# EAGLE design LEDCON.PCB (EAGLE 6.5.0)
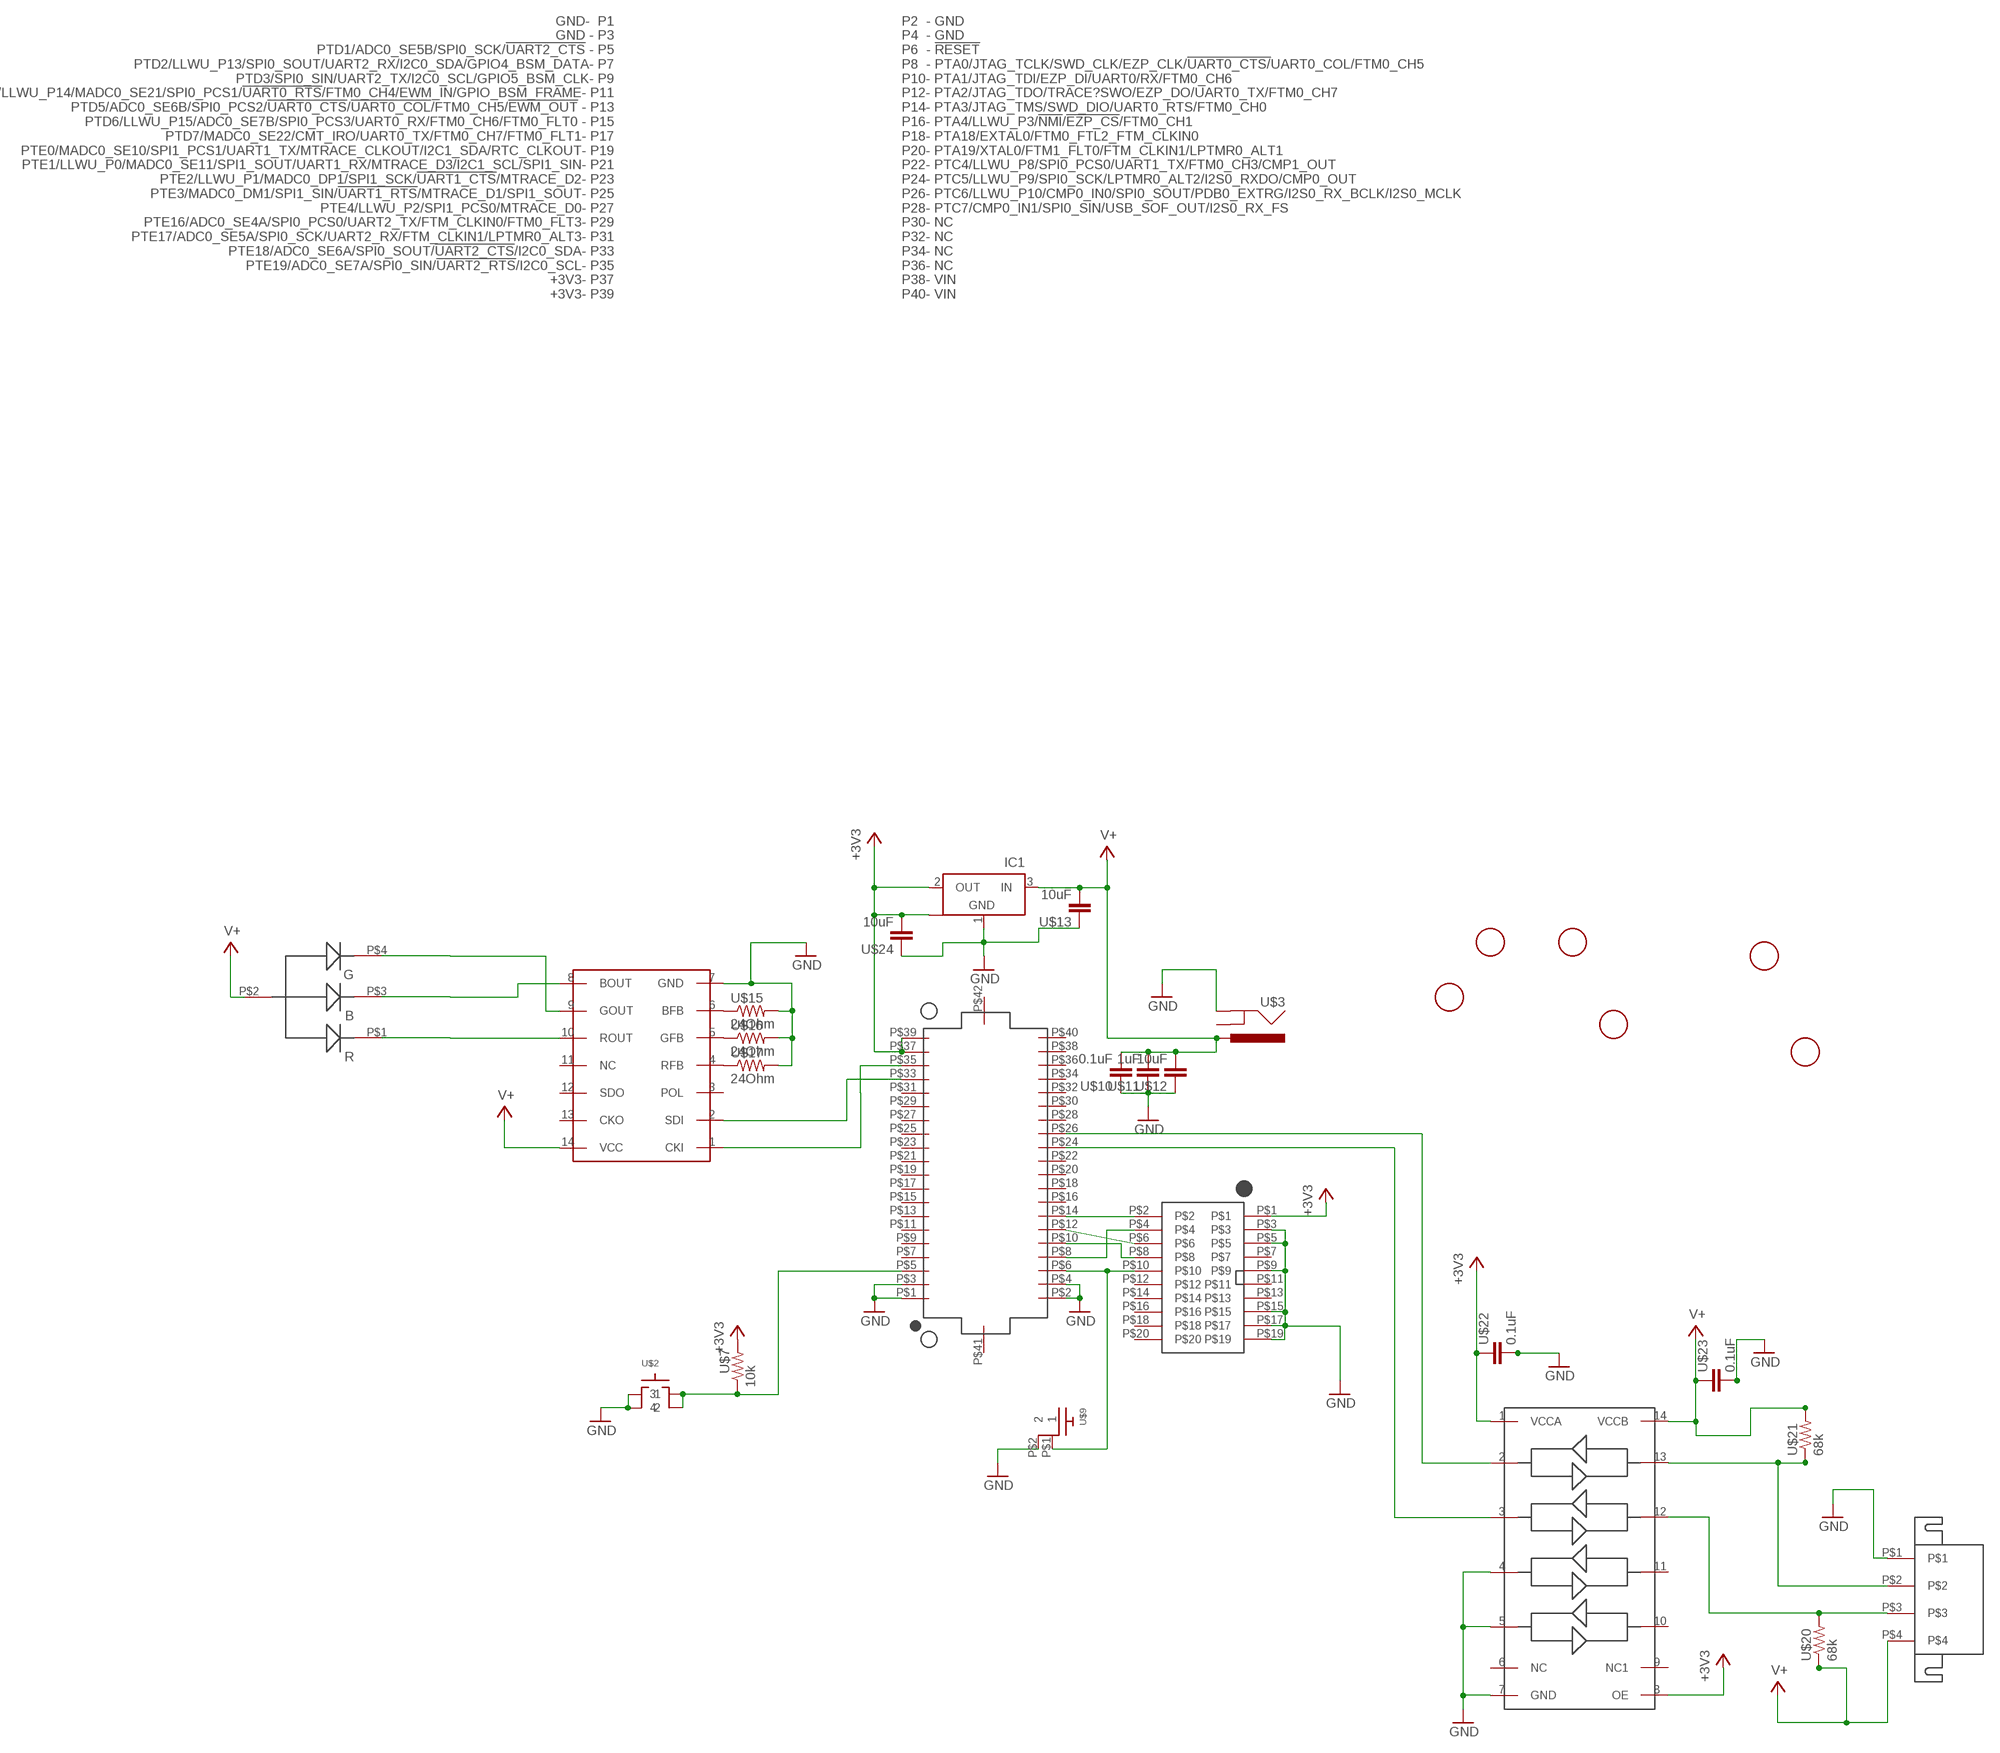
[diagram p0: schematic, sheet 1]

## Parts
IC1  NCP1117ST33T3G_1  [SOT223]
U$1  MATE-N-LOK_643230-1  [MATE-N-LOK_643230-1]
U$2  SWITCH-TACTILE  [ESWITCH-TL3301PF]
U$3  BARREL_CUI_PJ-002A  [BARREL_CUI_PJ-002A]
U$4  DF12_F  [DF12_F]
U$5  RGLBED  [PLCC4_SMALL]
U$6  TXB0104  [PW_R-PDSO-G14]
U$7  10k  RF-R0805  [RF-C0805]
U$8  WS2801  [SO14]
U$9  RA_BUTTON  [RA_BUTTON]
U$10  0.1uF  RF-C0805  [C0805]
U$11  1uF  RF-C0805  [C0805]
U$12  10uF  RF-C0805  [C0805]
U$13  10uF  RF-C0805  [C0805]
U$14  FIDUCIAL  [FIDUCIAL_1MM]
U$15  24Ohm  RF-R0805  [RF-C0805]
U$16  24Ohm  RF-R0805  [RF-C0805]
U$17  24Ohm  RF-R0805  [RF-C0805]
U$18  FIDUCIAL  [FIDUCIAL_1MM]
U$19  2X10JTAG  [2X10JTAG]
U$20  68k  RF-R0805  [RF-C0805]
U$21  68k  RF-R0805  [RF-C0805]
U$22  0.1uF  RF-C0805  [C0805]
U$23  0.1uF  RF-C0805  [C0805]
U$24  10uF  RF-C0805  [C0805]
U$25  FIDUCIAL  [FIDUCIAL_1MM]
U$26  FIDUCIAL  [FIDUCIAL_1MM]
U$27  FIDUCIAL  [FIDUCIAL_1MM]
U$28  FIDUCIAL  [FIDUCIAL_1MM]

## Nets
+3V3: IC1.2(OUT) IC1.4(OUT1) U$4.P$37(+3V3) U$4.P$39(+3V3) U$6.1(VCCA) U$6.8(OE) U$7.2 U$19.P$1 U$22.1 U$24.2
CLK_5V: U$1.P$3 U$6.12 U$20.2
DAT_5V: U$1.P$2 U$6.13 U$21.1
GND: IC1.1(GND) U$1.P$1 U$2.1 U$2.2 U$3.P$2(GND) U$4.P$1(GND) U$4.P$2(GND) U$4.P$3(GND) U$4.P$4(GND) U$6.4 U$6.5 U$6.7(GND) U$8.7(GND) U$9.P$2 U$10.1 U$11.1 U$12.1 U$13.1 U$15.2 U$16.2 U$17.2 U$19.P$3 U$19.P$5 U$19.P$9 U$19.P$15 U$19.P$17 U$19.P$19 U$22.2 U$23.2 U$24.1
N$1: U$4.P$26(PTC6/LLWU_P10/CMP0_IN0/SPI0_SOUT/PDB0_EXTRG/I2S0_RX_BCLK/I2S0_MCLK) U$6.2
N$2: U$4.P$24(PTC5/LLWU_P8/SPI0_PCS0/UART1_TX/FTM0_CH3/CMP1_OUT) U$6.3
N$3: U$4.P$6(!RESET) U$9.P$1 U$19.P$10
N$4: U$5.P$4(GREEN) U$8.9(GOUT)
N$5: U$5.P$3(BLUE) U$8.8(BOUT)
N$6: U$4.P$14(PTA3/JTAG_TMS/SWD_DIO/UART0_RTS/FTM0_CH0) U$19.P$2
N$7: U$5.P$1(RED) U$8.10(ROUT)
N$8: U$4.P$12(PTA2/JTAG_TDO/TRACE?SWO/EZP_DO/UART0_TX/FTM0_CH7) U$19.P$6
N$10: U$4.P$33(PTE18/ADC0_SE6A/SPI0_SOUT/!UART2_CTS!/I2C0_SDA) U$8.2(SDI)
N$11: U$8.6(BFB) U$15.1
N$12: U$8.5(GFB) U$16.1
N$13: U$8.4(RFB) U$17.1
N$14: U$4.P$35(PTE19/ADC0_SE7A/SPI0_SIN/!UART2_RTS!/I2C0_SCL) U$8.1(CKI)
N$18: U$4.P$8(PTA0/JTAG_TCLK/SWD_CLK/EZP_CLK/!UART0_CTS/!UART0_COL/FTM0_CH5) U$19.P$4
N$20: U$4.P$10(PTA1/JTAG_TDI/EZP_DI/UART0/RX/FTM0_CH6) U$19.P$8
N$21: U$2.3 U$2.4 U$4.P$5(PTD1/ADC0_SE5B/SPI0_SCK/!UART2_CTS) U$7.1
V+: IC1.3(IN) U$1.P$4 U$3.P$1(PWR) U$5.P$2(ANODE) U$6.14(VCCB) U$8.14(VCC) U$10.2 U$11.2 U$12.2 U$13.2 U$20.1 U$21.2 U$23.1
Unconnected: U$3.P$3(GNDBREAK) U$4.P$7(PTD2/LLWU_P13/SPI0_SOUT/UART2_RX/I2C0_SDA/GPIO4_BSM_DATA) U$4.P$9(PTD3/SPI0_SIN/UART2_TX/I2C0_SCL/GPIO5_BSM_CLK) U$4.P$11(PTD4/LLWU_P14/MADC0_SE21/SPI0_PCS1/!UART0_RTS!/FTM0_CH4/EWM_IN/GPIO_BSM_FRAME) U$4.P$13(PTD5/ADC0_SE6B/SPI0_PCS2/!UART0_CTS!/!UART0_COL!/FTM0_CH5/!EWM_OUT) U$4.P$15(PTD6/LLWU_P15/ADC0_SE7B/SPI0_PCS3/UART0_RX/FTM0_CH6/FTM0_FLT0) U$4.P$16(PTA4/LLWU_P3/!NMI!/!EZP_CS!/FTM0_CH1) U$4.P$17(PTD7/MADC0_SE22/CMT_IRO/UART0_TX/FTM0_CH7/FTM0_FLT1) U$4.P$18(PTA18/EXTAL0/FTM0_FTL2_FTM_CLKIN0) U$4.P$19(PTE0/MADC0_SE10/SPI1_PCS1/UART1_TX/MTRACE_CLKOUT/I2C1_SDA/RTC_CLKOUT) U$4.P$20(PTA19/XTAL0/FTM1_FLT0/FTM_CLKIN1/LPTMR0_ALT1) U$4.P$21(PTE1/LLWU_P0/MADC0_SE11/SPI1_SOUT/UART1_RX/MTRACE_D3/I2C1_SCL/SPI1_SIN) U$4.P$22(PTC4/LLWU_P8/SPI0_PCS0/UART1_TX/FTM0_CH3/CMP1_OUT) U$4.P$23(PTE2/LLWU_P1/MADC0_DP1/SPI1_SCK/!UART1_CTS!/MTRACE_D2) U$4.P$25(PTE3/MADC0_DM1/SPI1_SIN/!UART1_RTS!/MTRACE_D1/SPI1_SOUT) U$4.P$27(PTE4/LLWU_P2/SPI1_PCS0/MTRACE_D0) U$4.P$28(PTC7/CMP0_IN1/SPI0_SIN/USB_SOF_OUT/I2S0_RX_FS) U$4.P$29(PTE16/ADC0_SE4A/SPI0_PCS0/UART2_TX/FTM_CLKIN0/FTM0_FLT3) U$4.P$30(NC) U$4.P$31(PTE17/ADC0_SE5A/SPI0_SCK/UART2_RX/FTM_CLKIN1/LPTMR0_ALT3) U$4.P$32(NC) U$4.P$34(NC) U$4.P$36(NC) U$4.P$38(VIN) U$4.P$40(VIN) U$4.P$41 U$4.P$42 U$6.6(NC) U$6.9(NC1) U$6.10 U$6.11 U$8.3(POL) U$8.11(NC) U$8.12(SDO) U$8.13(CKO) U$19.P$7 U$19.P$11 U$19.P$12 U$19.P$13 U$19.P$14 U$19.P$16 U$19.P$18 U$19.P$20

## Library data of the parts
IC1 = KW2:NCP1117ST33T3G_1: VOLTAGE REGULATOR; MFGN: OnSemi; MFGP: NCP1117ST33T3G
U$1 = KW2:MATE-N-LOK_643230-1; MFGN: TE Connectivity; MFGP: 643230-1
U$2 = GW-devices:SWITCH-TACTILE; MFGN: E-Switch; MFGP: TL3301PF160QG
U$3 = KW2:BARREL_CUI_PJ-002A; MFGN: CUI; MFGP: PJ-002A
U$4 = KW2:DF12_F; MFGN: Hirose; MFGP: DF12(3.0)-40DP-0.5V(86)
U$5 = KW2:RGLBED; MFGN: Cree, Inc.; MFGP: CLV1A-FKB-CK1N1G1BB7R4S3
U$6 = texas:TXB0104; MFGN: Texas Instruments; MFGP: TXB0104PWR
U$7 = GW-devices:RF-R: RF resistor pads for FSL reference design; MFGN: Vishay Dale; MFGP: CRCW080510K0FKEA
U$8 = GW-devices:WS2801; MFGN: WorldSemi; MFGP: WS2801
U$9 = KW2:RA_BUTTON; MFGN: TE Connectivity; MFGP: 2-1825027-0
U$10 U$22 U$23 = GW-devices:RF-C: RF capacitor pads for FSL reference design; MFGN: TDK; MFGP: C2012X5R1H104K085AA
U$11 = GW-devices:RF-C: RF capacitor pads for FSL reference design; MFGN: TDK; MFGP: C2012X5R1E105K125AA
U$12 U$13 U$24 = GW-devices:RF-C: RF capacitor pads for FSL reference design; MFGN: Murata; MFGP: GRM219R61E106KA12D
U$14 U$18 U$25-U$28 = adafruit:FIDUCIAL: For use by pick and place machines to calibrate the vision/machine, 1mm By microbuilder.eu; NOTES: DNP
U$15-U$17 = GW-devices:RF-R: RF resistor pads for FSL reference design; MFGN: Vishay Dale; MFGP: CRCW080524R0FKEA
U$19 = KW2:2X10JTAG; MFGN: CNC Tech; MFGP: 3220-20-0100-00
U$20 U$21 = GW-devices:RF-R: RF resistor pads for FSL reference design; MFGN: Vishay Dale; MFGP: CRCW080568K0FKEA

## Board
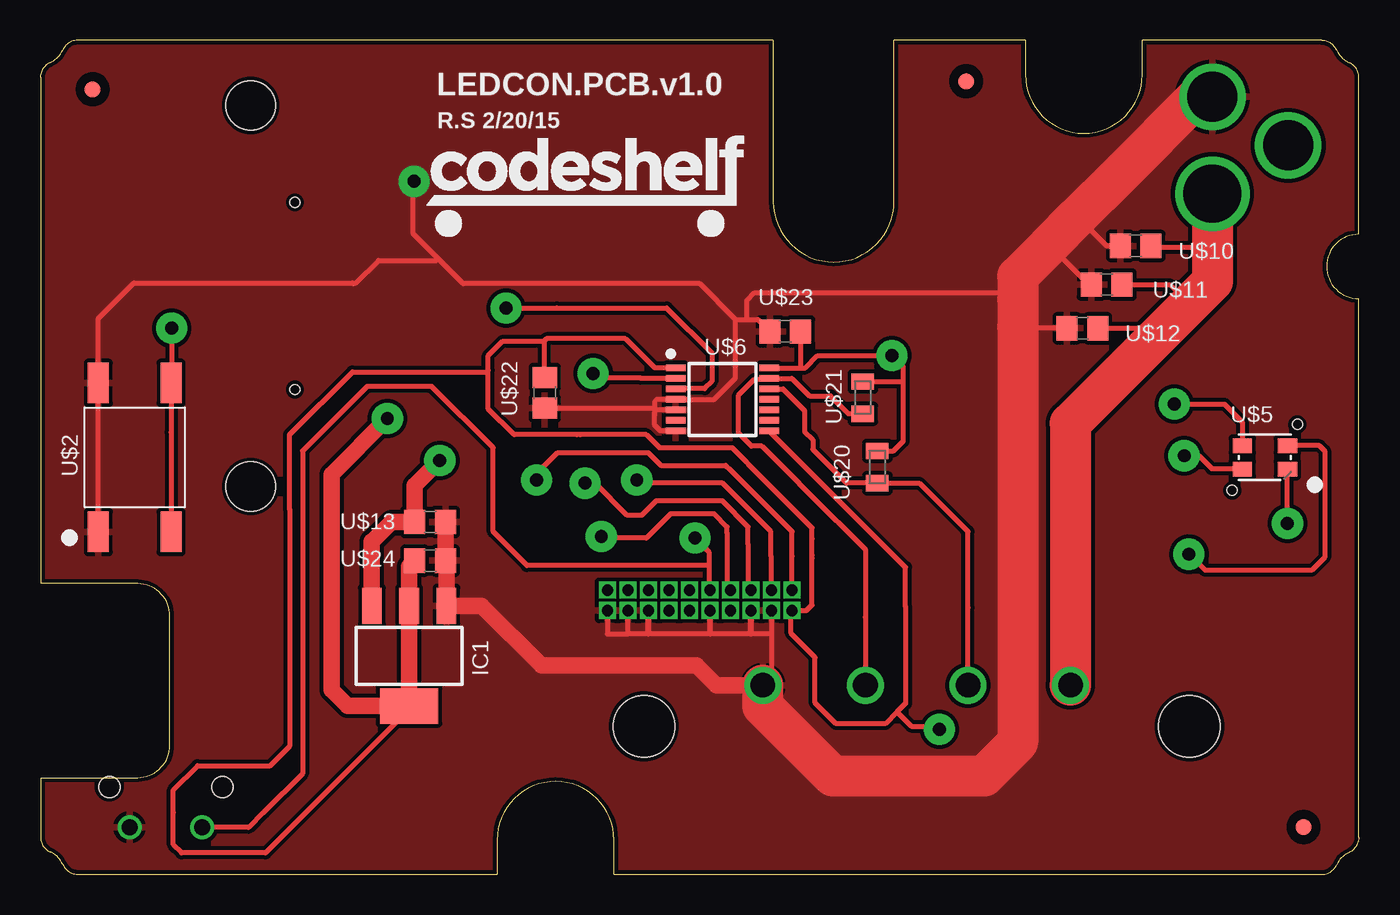
[diagram p1: board, top side]
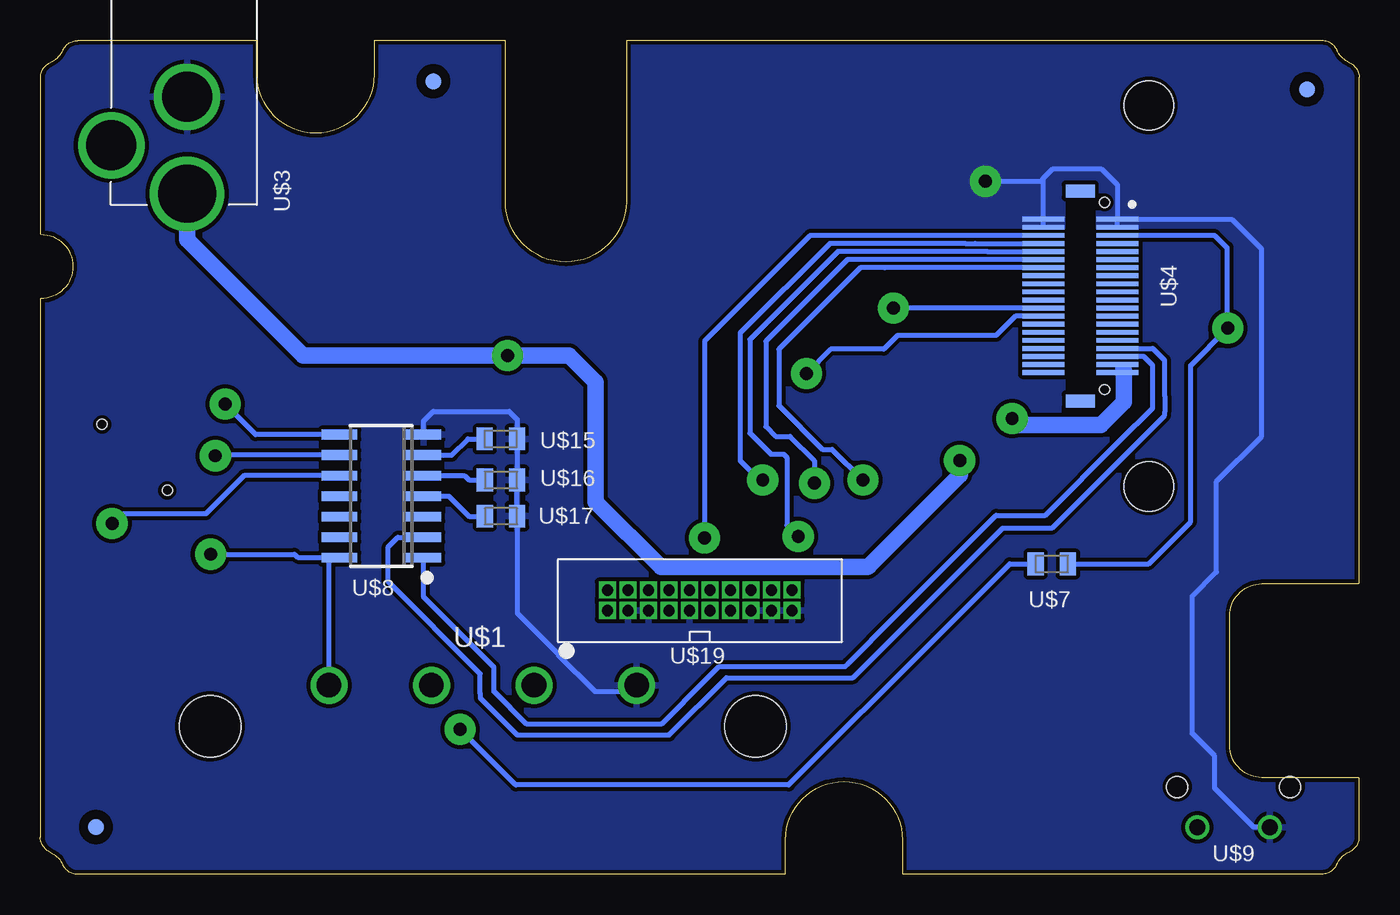
[diagram p2: board, bottom side, seen from below]

Size 81.68 x 51.66 mm. Coordinates in mm from the lower left corner, seen from the top.
Outline: 81.66,2.29 81.66,35.66 arc-180 81.66,39.65 81.66,49.38 arc66 81.07,50.28
Outline: 2.31,0 28.29,0 28.29,2.13 arc-180 35.53,2.13 35.53,0 79.37,0 arc67 80.29,0.61
Outline: 79.37,51.66 68.25,51.66 68.25,49.53 arc-180 61.01,49.53 61.01,51.66 52.88,51.66 52.88,41.68 arc-180 45.39,41.68 45.39,51.66 2.31,51.66 arc67 1.39,51.06
Outline: 0.02,49.38 0.02,18.01 6.02,18.01 arc-90 8.02,16 8.02,8 arc-90 6.02,5.99 0.02,5.99 0.02,2.29 arc66 0.61,1.38
Outline: 81.68,2.29 arc-66 81.07,1.37 arc43 80.3,0.6
Outline: 2.31,0.01 arc-67 1.39,0.61 arc43 0.61,1.39
Outline: 0,49.38 arc-66 0.61,50.29 arc43 1.38,51.06
Outline: 79.37,51.66 arc-67 80.29,51.05 arc43 81.07,50.28
Copper layers (1*16): Top 0.035mm / dielectric 1.5mm / Bottom 0.035mm
Design rules "default *": minimum track width 2.75mil, minimum drill 6mil, track to track 0.25mm, track to pad 0.25mm, pad to pad 0.25mm, via to via 0.25mm, smd to smd 0.25mm, copper to edge 0.25mm, drill to drill 0.25mm, minimum pad ring 6mil, minimum via ring 8mil, stop-mask expansion 4mil, vias tented up to drill 0.81mm, thermal gap 10mil

### Footprints (pad centres in the part's own frame; a part is rotated, then mirrored left to right if it is on the bottom)
SOT223 = smd 1.219 x 2.235: 1 -2.311,-3.099; 2 0,-3.099; 3 2.311,-3.099 | smd 3.6 x 2.2: 4 0,3.099
MATE-N-LOK_643230-1 = drill 1.52: P$1 0,0; P$2 6.35,0; P$3 12.7,0; P$4 19.05,0 | hole 3.81: -7.37,2.54; 26.42,2.54
ESWITCH-TL3301PF = smd 2.5 x 1.3: 1 -4.61,2.25; 2 4.61,2.25; 3 -4.61,-2.25; 4 4.61,-2.25
BARREL_CUI_PJ-002A = drill 3.6: P$1 0,0 | drill 3.1: P$2 6,0; P$3 3,4.7
DF12_F = smd 0.3 x 2.6: P$1 -4.75,2.3; P$2 -4.75,-2.3; P$3 -4.25,2.3; P$4 -4.25,-2.3; P$5 -3.75,2.3; P$6 -3.75,-2.3; P$7 -3.25,2.3; P$8 -3.25,-2.3; P$9 -2.75,2.3; P$10 -2.75,-2.3; P$11 -2.25,2.3; P$12 -2.25,-2.3; P$13 -1.75,2.3; P$14 -1.75,-2.3; P$15 -1.25,2.3; P$16 -1.25,-2.3; P$17 -0.75,2.3; P$18 -0.75,-2.3; P$19 -0.25,2.3; P$20 -0.25,-2.3; P$21 0.25,2.3; P$22 0.25,-2.3; P$23 0.75,2.3; P$24 0.75,-2.3; P$25 1.25,2.3; P$26 1.25,-2.3; P$27 1.75,2.3; P$28 1.75,-2.3; P$29 2.25,2.3; P$30 2.25,-2.3; P$31 2.75,2.3; P$32 2.75,-2.3; P$33 3.25,2.3; P$34 3.25,-2.3; P$35 3.75,2.3; P$36 3.75,-2.3; P$37 4.25,2.3; P$38 4.25,-2.3; P$39 4.75,2.3; P$40 4.75,-2.3 | smd 0.8 x 1.8: P$41 -6.5,0; P$42 6.5,0 | hole 0.6: -5.8,1.5; 5.8,1.5 | hole 3.048: -11.8,4.24; 11.8,4.24
PLCC4_SMALL = smd 1.2 x 0.9: P$1 1.4,-0.725; P$2 1.4,0.725; P$3 -1.4,0.725; P$4 -1.4,-0.725 | hole 0.61: 2.019,2.045; -2.019,-2.045
PW_R-PDSO-G14 = smd 0.4 x 1.2: 1 -1.95,-2.9; 2 -1.3,-2.9; 3 -0.65,-2.9; 4 0,-2.9; 5 0.65,-2.9; 6 1.3,-2.9; 7 1.95,-2.9; 8 1.95,2.9; 9 1.3,2.9; 10 0.65,2.9; 11 0,2.9; 12 -0.65,2.9; 13 -1.3,2.9; 14 -1.95,2.9
RF-C0805 = smd 1 x 1.4: 1 -1,0; 2 1,0
SO14 = smd 0.6 x 2.2: 1 -3.81,-2.6; 2 -2.54,-2.6; 3 -1.27,-2.6; 4 0,-2.6; 5 1.27,-2.6; 6 2.54,-2.6; 7 3.81,-2.6; 8 3.81,2.6; 9 2.54,2.6; 10 1.27,2.6; 11 0,2.6; 12 -1.27,2.6; 13 -2.54,2.6; 14 -3.81,2.6
RA_BUTTON = drill 0.99: P$1 -2.25,0; P$2 2.25,0 | hole 1.3: -3.501,2.49; 3.501,2.49
C0805 = smd 1.3 x 1.5: 1 -0.95,0; 2 0.95,0
FIDUCIAL_1MM = smd 1 x 1: 1 0,0
2X10JTAG = drill 0.7 pad 1 square: P$1 -6.35,-1.27; P$2 -6.35,0; P$3 -5.08,-1.27; P$4 -5.08,0; P$5 -3.81,-1.27; P$6 -3.81,0; P$7 -2.54,-1.27; P$8 -2.54,0; P$9 -1.27,-1.27; P$10 -1.27,0; P$11 0,-1.27; P$12 0,0; P$13 1.27,-1.27; P$14 1.27,0; P$15 2.54,-1.27; P$16 2.54,0; P$17 3.81,-1.27; P$18 3.81,0; P$19 5.08,-1.27; P$20 5.08,0

### Placement (x,y rotation side)
IC1  22.84,13.53 180 top
U$1  44.75,11.71 180 bottom
U$2  5.84,25.83 90 top
U$3  72.59,42.16 90 bottom
U$4  17.27,35.83 270 bottom
U$5  75.84,25.83 0 top
U$6  42.24,29.42 270 top
U$7  19.04,19.23 180 bottom
U$8  60.55,23.43 90 bottom
U$9  7.77,2.92 0 bottom
U$10  67.84,38.93 0 top
U$11  66.04,36.53 0 top
U$12  64.54,33.83 0 top
U$13  24.14,21.83 180 top
U$14  78.24,2.93 0 top
U$15  53.16,26.97 0 bottom
U$16  53.15,24.43 0 bottom
U$17  53.15,22.19 0 bottom
U$18  3.24,48.63 0 top
U$19  40.2,17.61 0 bottom
U$20  51.84,25.23 270 top
U$21  50.94,29.53 90 top
U$22  31.24,29.83 270 top
U$23  46.14,33.63 180 top
U$24  24.14,19.43 180 top
U$25  57.34,49.13 0 top
U$26  57.34,49.13 0 bottom
U$27  3.24,48.63 0 bottom
U$28  78.24,2.93 0 bottom

### Tracks (layer width: path | path; a pad name or v marks a point on that pad's centre or on a via)
+3V3  (via drill 0.8 pad 1.93)
  Top 0.305: 53.06,10.06 53.59,10.58 53.59,16.58 53.59,19.02 U$6.8 45.18,27.43 | 53.06,10.06 52.34,9.33 49.29,9.33 47.99,10.63 47.99,13.43 46.49,14.93 46.49,16.27 U$19.P$1 47.44,16.34 47.79,16.68 47.79,19.58 47.79,19.78 47.79,20.78 47.79,21.48 47.74,21.53 43.84,25.43 43.74,25.53 42.84,26.43 42.14,26.43 38.34,26.43 37.54,27.23 33.44,27.23 | 53.06,10.06 53.94,9.18 55.49,9.18 v55.69,8.98 | U$6.1 38.04,31.38 36.24,33.18 31.34,33.18 31.26,33.11 | 33.44,27.23 33.24,27.23 | U$22.1 31.24,33.08 31.26,33.11 | 33.44,27.23 29.34,27.23 27.74,28.83 27.74,31.23 | IC1.4 22.84,10.23 13.94,1.33 8.74,1.33 8.24,1.83 8.24,3.83 8.24,5.23 9.74,6.73 14.24,6.73 15.29,7.78 | 27.74,31.23 27.64,31.13 19.34,31.13 15.44,27.23 15.44,22.63 15.44,7.93 15.29,7.78 | 27.74,31.23 27.74,32.13 28.64,33.03 31.19,33.03 31.26,33.11 | 15.29,7.78 15.34,7.83
  Top 1.016: U$24.2 22.84,19.08 IC1.2 IC1.4 19.04,10.43 18.04,11.43 18.04,24.78 v21.49,28.23
  Bottom 0.305: 55.44,9.23 v55.69,8.98 52.24,5.53 35.34,5.53 26.24,14.63 21.64,19.23 U$7.2 | U$4.P$37 U$4.P$39 14.82,31.23 14.57,31.23
  Bottom 1.016: v21.49,28.23 21.09,27.83 18.19,27.83 15.99,27.83 14.57,29.25 14.57,29.26 14.57,31.23
CLK_5V
  Top 0.305: U$1.P$3 57.45,16.53 57.45,21.22 57.34,21.33 | U$6.12 46,30.07 47.34,28.73 47.34,27.43 47.84,26.93 47.84,26.33 49.14,25.03 49.94,24.23 U$20.2 54.44,24.23 57.34,21.33 | 57.34,21.33 57.44,21.23
DAT_5V
  Top 0.305: 49.29,21.93 49.39,21.83 | 49.39,21.83 51.09,20.13 51.09,15.93 U$1.P$2 | 49.29,21.93 49.39,21.83 | U$21.1 50.04,28.53 48.94,29.63 47.64,29.63 46.55,30.72 U$6.13 45.1,30.68 44.24,30.68 43.24,29.68 43.24,27.33 44.04,26.53 44.69,26.53 49.29,21.93
GND  (via drill 0.8 pad 1.93)
  Top 0.305: U$1.P$1 45.28,12.24 U$19.P$3 45.28,14.88 43.99,14.88 43.99,16.34 U$19.P$5 44.01,14.88 41.49,14.88 U$19.P$9 41.47,14.88 37.64,14.88 37.64,16.34 U$19.P$15 37.66,14.88 36.39,14.88 | 36.39,14.88 U$19.P$17 | U$19.P$19 35.12,14.88 36.39,14.88 | U$2.1 U$2.2 3.59,34.43 5.79,36.63 19.34,36.63 | U$6.7 38.4,27.47 38.04,27.83 38.04,28.43 | 38.04,28.43 38.04,28.63 | U$6.5 38.19,28.78 38.04,28.78 | 38.04,28.83 38.04,29.28 38.18,29.42 U$6.4 41.73,29.42 43.04,30.73 43.04,34.38 | 38.04,28.83 38.04,28.78 | 38.04,28.78 38.04,28.43 | 43.04,34.38 40.84,36.58 26.19,36.58 24.64,38.13 | 24.64,38.13 23.09,39.68 23.09,42.88 v23.14,42.93 | 19.34,36.63 19.54,36.63 20.94,38.03 24.54,38.03 24.64,38.13 | 19.39,36.58 19.34,36.63 | 43.04,34.38 43.75,34.38 | 43.75,34.38 44.44,34.38 U$23.2 | 31.19,28.93 U$22.2 37.99,28.88 38.04,28.83 | 43.75,34.38 43.75,35.54 44.24,36.03 60.14,36.03 60.54,35.63 | U$10.1 66.04,38.93 64.24,40.73 | U$11.1 64.94,36.53 62.49,38.98 | U$12.1 60.64,33.83 60.54,33.93
  Top 1.016: U$1.P$1 41.86,11.71 40.64,12.93 31.04,12.93 27.34,16.63 IC1.1 25.15,19.37 U$24.1 U$13.1
  Top 2.54: U$3.P$2 71.67,48.16 66.79,43.28 64.24,40.73 62.49,38.98 60.54,37.03 60.54,35.63 60.54,33.93 60.54,8.18 58.44,6.08 49.09,6.08 44.75,10.42 U$1.P$1
  Bottom 0.305: 19.59,42.93 19.59,43.08 18.99,43.68 15.94,43.68 14.97,42.71 U$4.P$1 | 19.59,42.93 19.59,40.6 | U$8.7 57.95,28.07 57.34,28.68 52.64,28.68 52.14,28.18 52.14,26.99 U$15.2 52.16,24.35 52.09,24.28 52.09,24.37 U$16.2 U$17.2 52.15,16.19 49.64,13.68 49.64,13.63 47.34,11.33 45.13,11.33 U$1.P$1 | v23.14,42.93 19.59,42.93 | U$4.P$3 U$4.P$1 | U$4.P$1 | U$4.P$4 U$4.P$2 19.59,40.6 | 19.59,40.6 | 6.53,2.92 6.54,2.93 | 6.54,2.93 8.94,5.33 8.94,7.33 10.34,8.73 10.34,17.23 8.84,18.73 8.84,24.33 6.04,27.13 6.04,38.73 7.74,40.43 7.89,40.58 U$4.P$1 | 6.54,2.93 U$9.P$2
  pour Bottom: -0.86,52.33 83.14,52.33 83.14,-1.27 -0.76,-1.27
  pour Top: -1.66,52.33 82.64,52.33 82.64,-0.97 -1.66,-0.97
N$1  (via drill 0.8 pad 1.93)
  Top 0.305: U$6.2 37.19,30.73 35.04,30.73 34.54,30.73 v34.24,31.03
  Bottom 0.305: U$4.P$26 21.29,34.58 22.49,33.38 28.59,33.38 29.44,32.53 32.74,32.53 v34.24,31.03
N$2  (via drill 0.8 pad 1.93)
  Top 0.305: v28.84,35.08 31.99,35.08 38.79,35.08 41.59,32.28 41.59,30.53 41.14,30.08 39.35,30.08 U$6.3
  Bottom 0.305: U$4.P$24 v28.84,35.08
N$3  (via drill 0.8 pad 1.93)
  Top 0.305: U$19.P$10 41.44,17.64 41.44,19.13 | 41.44,19.13 41.44,19.23 41.44,19.93 v40.54,20.83 | 41.44,19.13 30.14,19.13 28.04,21.23 28.04,26.43 24.24,30.23 20.24,30.23 16.24,26.23 16.24,6.23 13.84,3.83 12.93,2.92 12.83,2.92 U$9.P$1
  Bottom 0.305: U$4.P$6 25.99,39.58 26.59,39.58 27.04,39.58 28.74,39.58 33.99,39.58 34.14,39.43 | 34.14,39.43 36.24,37.33 40.54,33.03 40.54,25.03 v40.54,20.83 | 34.14,39.43 34.04,39.53
N$4  (via drill 0.8 pad 1.93)
  Top 0.305: v70.84,25.93 71.74,25.93 72.54,25.13 74.41,25.13 U$5.P$4
  Bottom 0.305: U$8.9 70.8,25.97 v70.84,25.93
N$5  (via drill 0.8 pad 1.93)
  Top 0.305: v70.24,29.13 73.34,29.13 74.44,28.03 U$5.P$3
  Bottom 0.305: U$8.8 68.35,27.24 v70.24,29.13
N$6  (via drill 0.8 pad 1.93)
  Top 0.305: U$19.P$2 46.55,19.72 46.55,21.22 46.54,21.23 42.64,25.13 42.54,25.23 42.44,25.33 38.44,25.33 37.64,26.13 32.04,26.13 30.74,24.83 v30.74,24.43
  Bottom 0.305: U$4.P$14 29.39,37.58 30.89,37.58 35.94,32.53 35.94,29.03 33.24,26.33 32.64,26.33 v30.74,24.43
N$7  (via drill 0.8 pad 1.93)
  Top 0.305: v77.24,21.73 U$5.P$1
  Bottom 0.305: U$8.10 69.07,24.7 71.44,22.33 76.64,22.33 v77.24,21.73
N$8  (via drill 0.8 pad 1.93)
  Top 0.305: U$19.P$6 43.84,17.78 43.84,20.43 43.84,21.53 42.24,23.13 38.14,23.13 37.24,22.23 36.34,22.23 34.34,24.23 v33.74,24.23
  Bottom 0.305: U$4.P$12 30.19,38.08 31.69,38.08 36.74,33.03 36.74,27.73 36.14,27.13 35.24,27.13 33.74,25.63 v33.74,24.23
N$10
  Bottom 0.305: U$4.P$33 12.79,32.58 12.04,31.83 12.04,29.63 12.04,28.63 12.04,28.43 14.34,26.13 15.54,24.93 19.04,21.43 22.09,21.43 31.34,12.18 39.19,12.18 42.74,8.63 52.14,8.63 54.44,10.93 54.44,11.18 54.44,12.43 60.14,18.13 60.14,20.28 59.54,20.88 U$8.2
N$11
  Bottom 0.305: U$8.6 56.2,25.97 55.19,26.98 U$15.1
N$12
  Bottom 0.305: U$8.5 55.41,24.7 55.14,24.43 U$16.1
N$13
  Bottom 0.305: U$8.4 56.39,23.43 55.14,22.18 U$17.1
N$14
  Bottom 0.305: U$4.P$35 13.34,32.08 12.79,31.53 12.79,29.93 12.79,28.93 12.79,28.88 14.84,26.83 19.44,22.23 22.49,22.23 28.84,15.88 31.64,13.08 31.84,12.88 39.64,12.88 40.44,12.08 43.19,9.33 51.59,9.33 53.59,11.33 53.59,12.83 57.94,17.18 U$8.1
N$18  (via drill 0.8 pad 1.93)
  Top 0.305: U$19.P$4 45.24,17.65 45.24,19.73 45.24,21.23 42.24,24.23 37.14,24.23 v36.94,24.43
  Bottom 0.305: U$4.P$8 23.79,39.08 24.39,39.08 26.09,39.08 30.99,39.08 32.79,39.08 38.34,33.53 38.34,25.63 37.04,24.33 v36.94,24.43
N$20  (via drill 0.8 pad 1.93)
  Top 0.305: U$19.P$8 42.54,17.81 42.54,21.13 42.54,21.53 41.74,22.33 39.04,22.33 37.54,20.83 34.84,20.83 v34.74,20.93
  Bottom 0.305: 23.04,38.58 19.99,38.58 U$4.P$10 | 23.04,38.58 23.09,38.58 | 23.04,38.58 24.54,38.58 29.09,38.58 30.69,38.58 32.29,38.58 37.74,33.13 37.74,27.33 36.44,26.03 35.64,26.03 35.44,25.83 35.44,21.63 v34.74,20.93
N$21  (via drill 0.8 pad 1.93)
  Top 0.305: U$2.4 8.09,30.33 | 8.09,30.33 8.09,27.38 U$2.3 | v8.14,33.83 8.14,30.58 7.94,30.38 8.04,30.38 8.09,30.33
  Bottom 0.305: U$4.P$5 8.94,39.58 8.19,38.83 8.19,33.88 v8.14,33.83 10.44,31.53 10.44,21.83 13.04,19.23 U$7.1
V+  (via drill 0.8 pad 1.93)
  Top 0.305: U$6.14 47.04,31.37 | U$23.1 47.09,33.33 | 47.09,33.33 47.09,31.42 47.04,31.37 | 47.04,33.38 47.09,33.33 | 47.04,31.37 47.38,31.37 48.14,32.13 48.94,32.13 v52.74,32.13 53.44,31.43 53.44,30.53 | 50.84,30.63 U$21.2 53.44,30.53 | U$20.1 52.84,26.23 53.44,26.83 53.44,30.53 | v71.14,19.83 72.14,18.83 78.74,18.83 79.54,19.63 79.54,26.23 79.21,26.56 U$5.P$2 | 72.59,38.83 68.89,38.83 U$10.2 | U$12.2 68.34,33.83 69.01,33.16 | U$11.2 69.94,36.53 71.16,35.31
  Top 1.016: IC1.3 20.53,20.62 20.54,20.63 21.74,21.83 U$13.2 23.19,24.08 v24.74,25.63
  Top 2.54: U$3.P$1 72.59,42.08 72.59,38.83 72.59,36.73 71.16,35.31 69.01,33.16 63.79,27.93 U$1.P$4
  Bottom 0.305: U$1.P$4 63.79,19.48 63.64,19.63 | v24.74,25.63 24.74,24.73 | v71.14,19.83 65.94,19.83 65.74,19.63 63.64,19.63 | 63.64,19.63 U$8.14
  Bottom 1.016: U$3.P$1 72.59,39.33 65.39,32.13 v52.74,32.13 48.94,32.13 47.29,30.48 47.29,25.13 47.29,23.28 47.29,23.08 43.24,19.03 30.44,19.03 30.34,19.13 24.74,24.73

### Text on the board
tPlace: LEDCON.PCB.v1.0 | R.S 2/20/15